# Altium project sokolov_control_board.PrjPcb
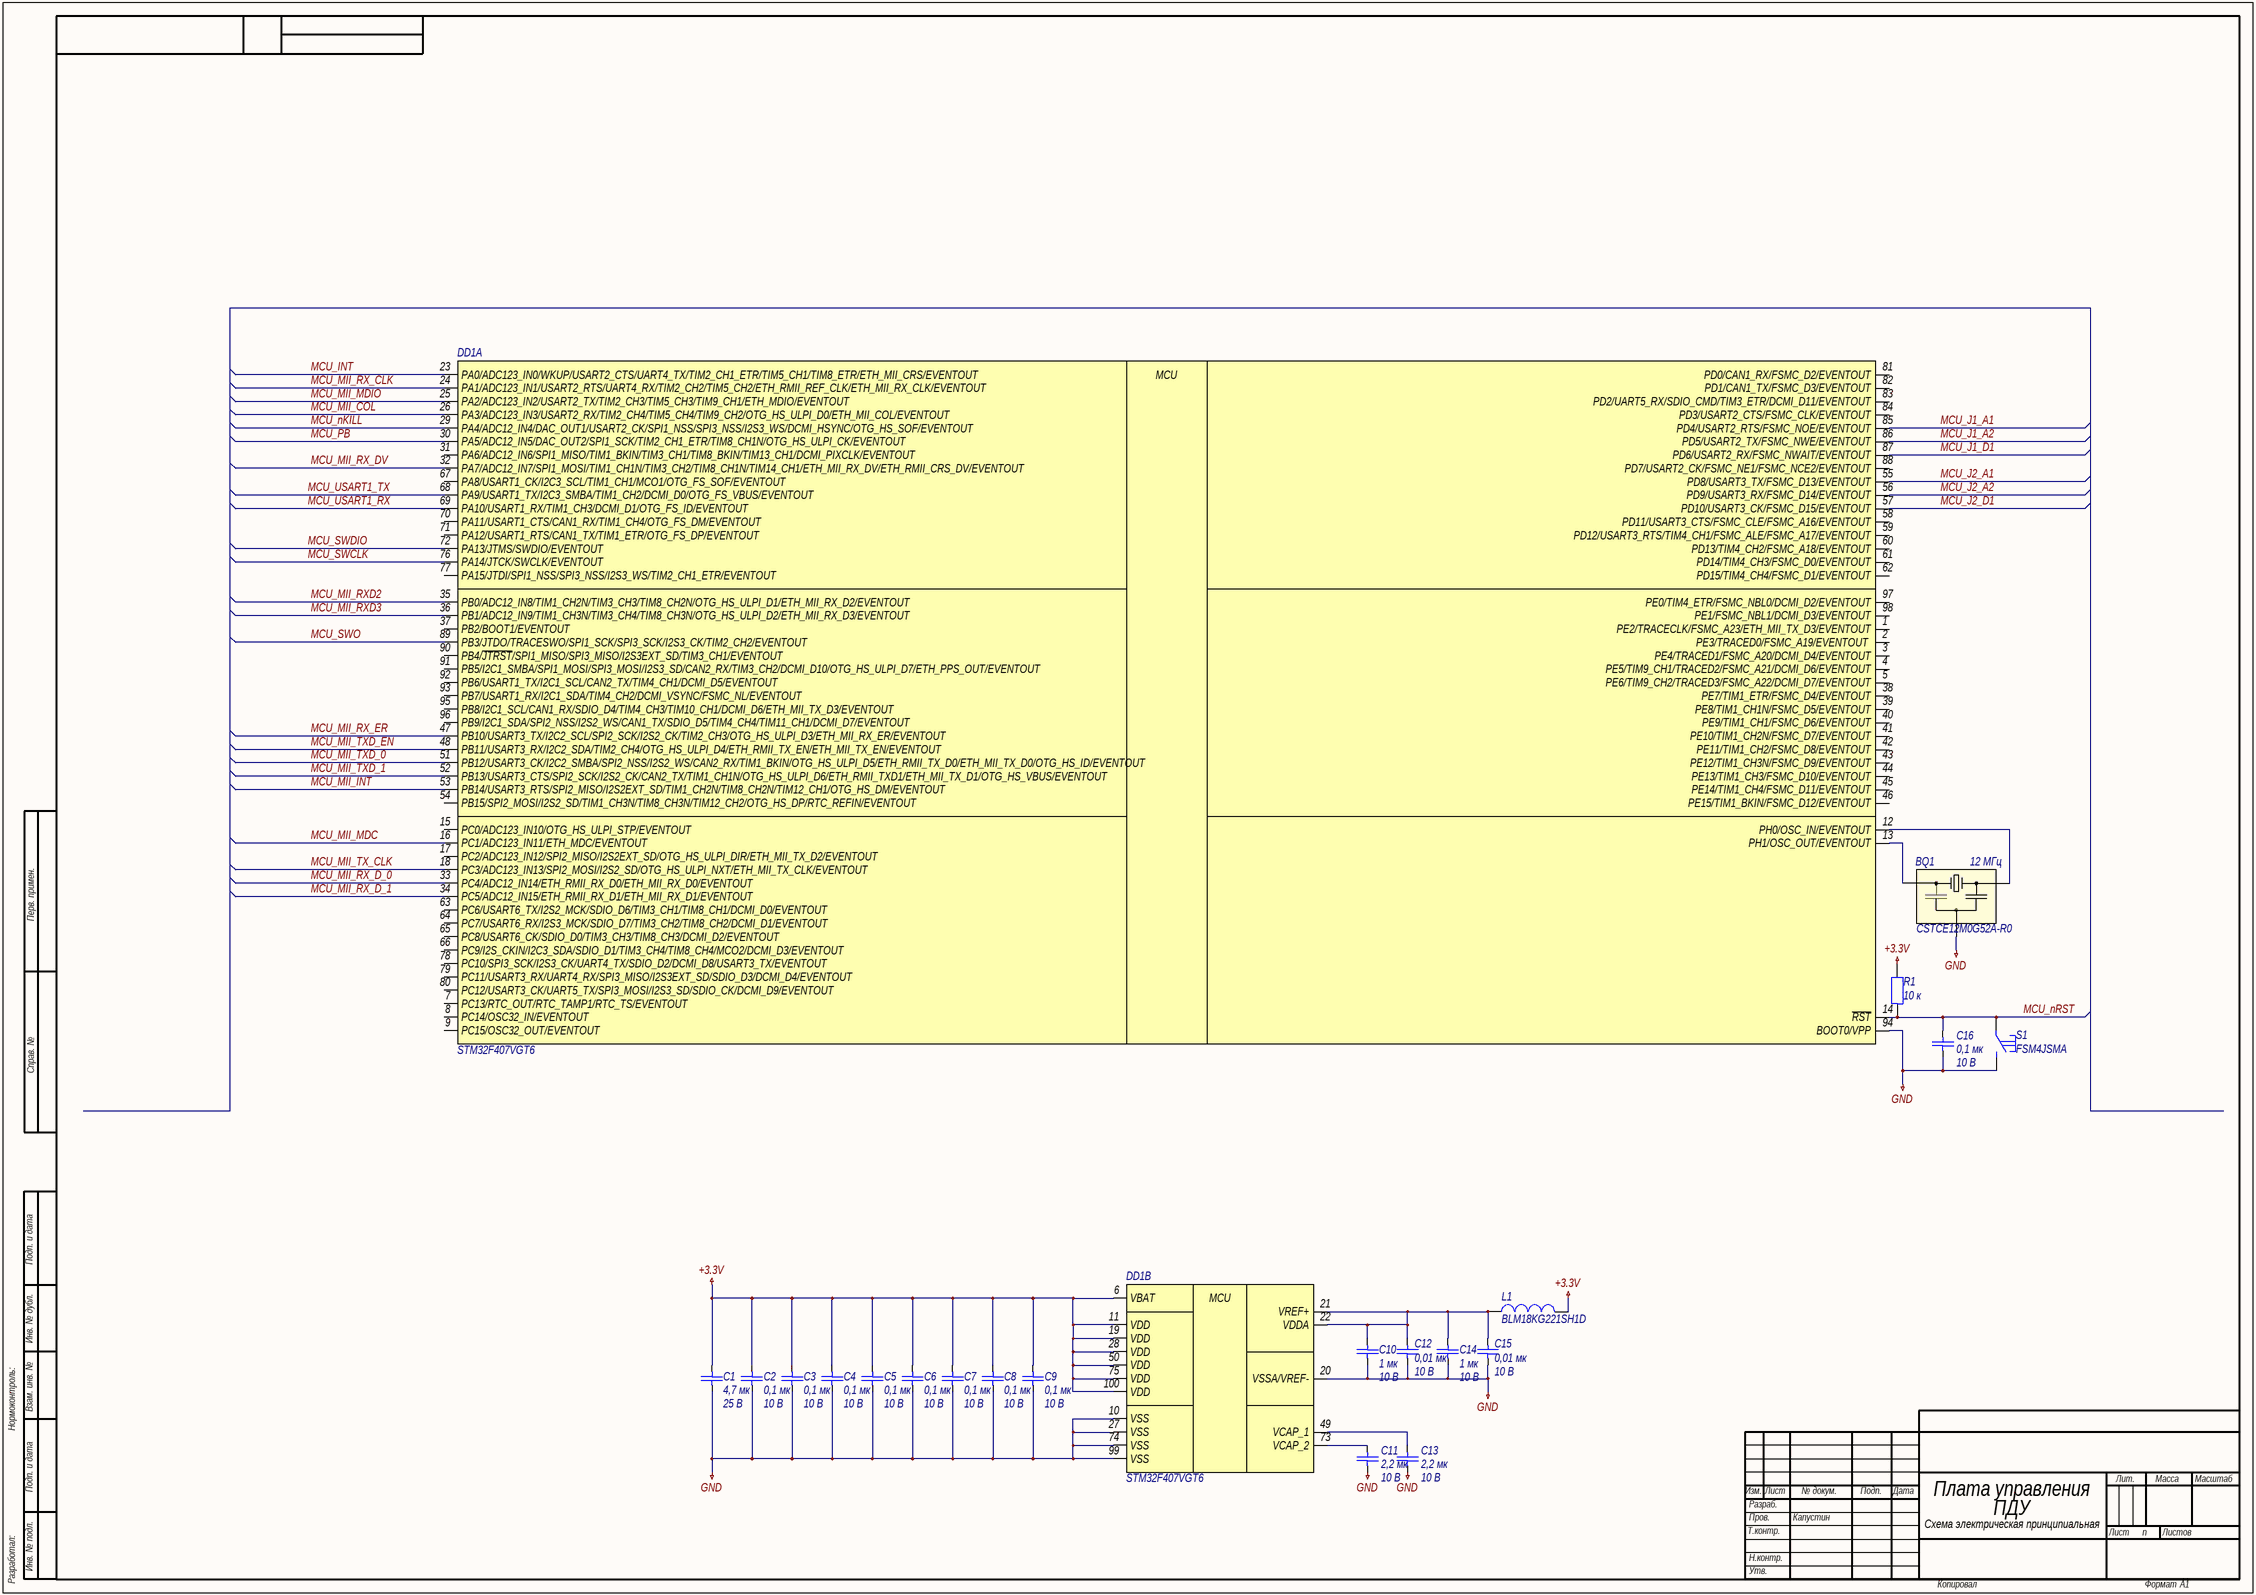
[diagram p0: sokolov_control_board_1.SchDoc]
approver: Капустин; check: Капустин; designation: СПБПУ.3331506.022; developer: Соколов; document_code: Ý3; document_type: Схема электрическая принципиальная; pcb_dec_number: СПБПУ.3331506.022; project: Плата управления ПДУ; sheets_total: 3; title: Плата управления ПДУ; title_line_1: Плата управления; title_line_2: ПДУ
3 sheets, 108 parts. Net scope: global (net labels, ports and power ports of the same name join across sheets).
Board file: 1,5mm_18um_4layers_std.PcbDoc
Sheets:
  sokolov_control_board_1.SchDoc
  sokolov_control_board_2.SchDoc
  sokolov_control_board_3.SchDoc

## Sheet sokolov_control_board_1.SchDoc: Плата управления ПДУ
size 840 x 594 mm; ApprovedBy: Капустин; CheckedBy: Капустин; DrawnBy: Соколов; DocumentNumber: СПБПУ.3331506.022Ý3; SheetNumber: n; SheetTotal: 3; DocumentCode: Ý3; ImagePath: СПБПУ.3331506.022

### Parts
BQ1  CSTCE12M0G52A-R0  Частотa: 12 МГц  [CSTCE-3-P120-320X130X70]
C1  4,7 мк  Напряжение: 25 В  [C0805]
C2  0,1 мк  Напряжение: 10 В  [C0603]
C3  0,1 мк  Напряжение: 10 В  [C0603]
C4  0,1 мк  Напряжение: 10 В  [C0603]
C5  0,1 мк  Напряжение: 10 В  [C0603]
C6  0,1 мк  Напряжение: 10 В  [C0603]
C7  0,1 мк  Напряжение: 10 В  [C0603]
C8  0,1 мк  Напряжение: 10 В  [C0603]
C9  0,1 мк  Напряжение: 10 В  [C0603]
C10  1 мк  Напряжение: 10 В  [C0603]
C11  2,2 мк  Напряжение: 10 В  [C0603]
C12  0,01 мк  Напряжение: 10 В  [C0603]
C13  2,2 мк  Напряжение: 10 В  [C0603]
C14  1 мк  Напряжение: 10 В  [C0603]
C15  0,01 мк  Напряжение: 10 В  [C0603]
C16  0,1 мк  Напряжение: 10 В  [C0603]
DD1  STM32F407VGT6  [LQFP-100-P50-1400X1400X160-L60X22]  (parts A,B of 2)
L1  BLM18KG221SH1D  [BLM-2-0603]
R1  10 к  [R0603]
S1  FSM4JSMA  [FSM4JSMA]

### Nets
+3.3V: C1.2 C2.2 C3.2 C4.2 C5.2 C6.2 C7.2 C8.2 C9.2 DD1.6(VBAT) DD1.11(VDD) DD1.19(VDD) DD1.28(VDD) DD1.50(VDD) DD1.75(VDD) DD1.100(VDD) L1.2 R1.2
GND: BQ1.2 C1.1 C2.1 C3.1 C4.1 C5.1 C6.1 C7.1 C8.1 C9.1 C10.1 C11.2 C12.2 C13.2 C14.1 C15.2 C16.2 DD1.10(VSS) DD1.20(VSSA/VREF-) DD1.27(VSS) DD1.74(VSS) DD1.94(BOOT0/VPP) DD1.99(VSS) S1.2
MCU_INT: DD1.23(PA0/ADC123_IN0/WKUP/USART2_CTS/UART4_TX/TIM2_CH1_ETR/TIM5_CH1/TIM8_ETR/ETH_MII_CRS/EVENTOUT)
MCU_J1_A1: DD1.85(PD4/USART2_RTS/FSMC_NOE/EVENTOUT)
MCU_J1_A2: DD1.86(PD5/USART2_TX/FSMC_NWE/EVENTOUT)
MCU_J1_D1: DD1.87(PD6/USART2_RX/FSMC_NWAIT/EVENTOUT)
MCU_J2_A1: DD1.55(PD8/USART3_TX/FSMC_D13/EVENTOUT)
MCU_J2_A2: DD1.56(PD9/USART3_RX/FSMC_D14/EVENTOUT)
MCU_J2_D1: DD1.57(PD10/USART3_CK/FSMC_D15/EVENTOUT)
MCU_MII_COL: DD1.26(PA3/ADC123_IN3/USART2_RX/TIM2_CH4/TIM5_CH4/TIM9_CH2/OTG_HS_ULPI_D0/ETH_MII_COL/EVENTOUT)
MCU_MII_INT: DD1.53(PB14/USART3_RTS/SPI2_MISO/I2S2EXT_SD/TIM1_CH2N/TIM8_CH2N/TIM12_CH1/OTG_HS_DM/EVENTOUT)
MCU_MII_MDC: DD1.16(PC1/ADC123_IN11/ETH_MDC/EVENTOUT)
MCU_MII_MDIO: DD1.25(PA2/ADC123_IN2/USART2_TX/TIM2_CH3/TIM5_CH3/TIM9_CH1/ETH_MDIO/EVENTOUT)
MCU_MII_RX_CLK: DD1.24(PA1/ADC123_IN1/USART2_RTS/UART4_RX/TIM2_CH2/TIM5_CH2/ETH_RMII_REF_CLK/ETH_MII_RX_CLK/EVENTOUT)
MCU_MII_RX_D_0: DD1.33(PC4/ADC12_IN14/ETH_RMII_RX_D0/ETH_MII_RX_D0/EVENTOUT)
MCU_MII_RX_D_1: DD1.34(PC5/ADC12_IN15/ETH_RMII_RX_D1/ETH_MII_RX_D1/EVENTOUT)
MCU_MII_RX_DV: DD1.32(PA7/ADC12_IN7/SPI1_MOSI/TIM1_CH1N/TIM3_CH2/TIM8_CH1N/TIM14_CH1/ETH_MII_RX_DV/ETH_RMII_CRS_DV/EVENTOUT)
MCU_MII_RX_ER: DD1.47(PB10/USART3_TX/I2C2_SCL/SPI2_SCK/I2S2_CK/TIM2_CH3/OTG_HS_ULPI_D3/ETH_MII_RX_ER/EVENTOUT)
MCU_MII_RXD2: DD1.35(PB0/ADC12_IN8/TIM1_CH2N/TIM3_CH3/TIM8_CH2N/OTG_HS_ULPI_D1/ETH_MII_RX_D2/EVENTOUT)
MCU_MII_RXD3: DD1.36(PB1/ADC12_IN9/TIM1_CH3N/TIM3_CH4/TIM8_CH3N/OTG_HS_ULPI_D2/ETH_MII_RX_D3/EVENTOUT)
MCU_MII_TX_CLK: DD1.18(PC3/ADC123_IN13/SPI2_MOSI/I2S2_SD/OTG_HS_ULPI_NXT/ETH_MII_TX_CLK/EVENTOUT)
MCU_MII_TXD_0: DD1.51(PB12/USART3_CK/I2C2_SMBA/SPI2_NSS/I2S2_WS/CAN2_RX/TIM1_BKIN/OTG_HS_ULPI_D5/ETH_RMII_TX_D0/ETH_MII_TX_D0/OTG_HS_ID/EVENTOUT)
MCU_MII_TXD_1: DD1.52(PB13/USART3_CTS/SPI2_SCK/I2S2_CK/CAN2_TX/TIM1_CH1N/OTG_HS_ULPI_D6/ETH_RMII_TXD1/ETH_MII_TX_D1/OTG_HS_VBUS/EVENTOUT)
MCU_MII_TXD_EN: DD1.48(PB11/USART3_RX/I2C2_SDA/TIM2_CH4/OTG_HS_ULPI_D4/ETH_RMII_TX_EN/ETH_MII_TX_EN/EVENTOUT)
MCU_nKILL: DD1.29(PA4/ADC12_IN4/DAC_OUT1/USART2_CK/SPI1_NSS/SPI3_NSS/I2S3_WS/DCMI_HSYNC/OTG_HS_SOF/EVENTOUT)
MCU_nRST: C16.1 DD1.14(~{RST}) R1.1 S1.1
MCU_PB: DD1.30(PA5/ADC12_IN5/DAC_OUT2/SPI1_SCK/TIM2_CH1_ETR/TIM8_CH1N/OTG_HS_ULPI_CK/EVENTOUT)
MCU_SWCLK: DD1.76(PA14/JTCK/SWCLK/EVENTOUT)
MCU_SWDIO: DD1.72(PA13/JTMS/SWDIO/EVENTOUT)
MCU_SWO: DD1.89(PB3/JTDO/TRACESWO/SPI1_SCK/SPI3_SCK/I2S3_CK/TIM2_CH2/EVENTOUT)
MCU_USART1_RX: DD1.69(PA10/USART1_RX/TIM1_CH3/DCMI_D1/OTG_FS_ID/EVENTOUT)
MCU_USART1_TX: DD1.68(PA9/USART1_TX/I2C3_SMBA/TIM1_CH2/DCMI_D0/OTG_FS_VBUS/EVENTOUT)
NetBQ1_1: BQ1.1 DD1.12(PH0/OSC_IN/EVENTOUT)
NetBQ1_3: BQ1.3 DD1.13(PH1/OSC_OUT/EVENTOUT)
NetC10_2: C10.2 C12.1 C14.2 C15.1 DD1.21(VREF+) DD1.22(VDDA) L1.1
NetC11_1: C11.1 DD1.73(VCAP_2)
NetC13_1: C13.1 DD1.49(VCAP_1)

Not connected (* = marked no-connect by the designer): DD1 1(PE2/TRACECLK/FSMC_A23/ETH_MII_TX_D3/EVENTOUT) 2(PE3/TRACED0/FSMC_A19/EVENTOUT_) 3(PE4/TRACED1/FSMC_A20/DCMI_D4/EVENTOUT) 4(PE5/TIM9_CH1/TRACED2/FSMC_A21/DCMI_D6/EVENTOUT) 5(PE6/TIM9_CH2/TRACED3/FSMC_A22/DCMI_D7/EVENTOUT) 7(PC13/RTC_OUT/RTC_TAMP1/RTC_TS/EVENTOUT) 8(PC14/OSC32_IN/EVENTOUT) 9(PC15/OSC32_OUT/EVENTOUT) 15(PC0/ADC123_IN10/OTG_HS_ULPI_STP/EVENTOUT) 17(PC2/ADC123_IN12/SPI2_MISO/I2S2EXT_SD/OTG_HS_ULPI_DIR/ETH_MII_TX_D2/EVENTOUT) 31(PA6/ADC12_IN6/SPI1_MISO/TIM1_BKIN/TIM3_CH1/TIM8_BKIN/TIM13_CH1/DCMI_PIXCLK/EVENTOUT) 37(PB2/BOOT1/EVENTOUT) 38(PE7/TIM1_ETR/FSMC_D4/EVENTOUT) 39(PE8/TIM1_CH1N/FSMC_D5/EVENTOUT) 40(PE9/TIM1_CH1/FSMC_D6/EVENTOUT) 41(PE10/TIM1_CH2N/FSMC_D7/EVENTOUT) 42(PE11/TIM1_CH2/FSMC_D8/EVENTOUT) 43(PE12/TIM1_CH3N/FSMC_D9/EVENTOUT) 44(PE13/TIM1_CH3/FSMC_D10/EVENTOUT) 45(PE14/TIM1_CH4/FSMC_D11/EVENTOUT) 46(PE15/TIM1_BKIN/FSMC_D12/EVENTOUT) 54(PB15/SPI2_MOSI/I2S2_SD/TIM1_CH3N/TIM8_CH3N/TIM12_CH2/OTG_HS_DP/RTC_REFIN/EVENTOUT) 58(PD11/USART3_CTS/FSMC_CLE/FSMC_A16/EVENTOUT) 59(PD12/USART3_RTS/TIM4_CH1/FSMC_ALE/FSMC_A17/EVENTOUT) 60(PD13/TIM4_CH2/FSMC_A18/EVENTOUT) 61(PD14/TIM4_CH3/FSMC_D0/EVENTOUT) 62(PD15/TIM4_CH4/FSMC_D1/EVENTOUT) 63(PC6/USART6_TX/I2S2_MCK/SDIO_D6/TIM3_CH1/TIM8_CH1/DCMI_D0/EVENTOUT) 64(PC7/USART6_RX/I2S3_MCK/SDIO_D7/TIM3_CH2/TIM8_CH2/DCMI_D1/EVENTOUT) 65(PC8/USART6_CK/SDIO_D0/TIM3_CH3/TIM8_CH3/DCMI_D2/EVENTOUT) 66(PC9/I2S_CKIN/I2C3_SDA/SDIO_D1/TIM3_CH4/TIM8_CH4/MCO2/DCMI_D3/EVENTOUT) 67(PA8/USART1_CK/I2C3_SCL/TIM1_CH1/MCO1/OTG_FS_SOF/EVENTOUT) 70(PA11/USART1_CTS/CAN1_RX/TIM1_CH4/OTG_FS_DM/EVENTOUT) 71(PA12/USART1_RTS/CAN1_TX/TIM1_ETR/OTG_FS_DP/EVENTOUT) 77(PA15/JTDI/SPI1_NSS/SPI3_NSS/I2S3_WS/TIM2_CH1_ETR/EVENTOUT) 78(PC10/SPI3_SCK/I2S3_CK/UART4_TX/SDIO_D2/DCMI_D8/USART3_TX/EVENTOUT_) 79(PC11/USART3_RX/UART4_RX/SPI3_MISO/I2S3EXT_SD/SDIO_D3/DCMI_D4/EVENTOUT) 80(PC12/USART3_CK/UART5_TX/SPI3_MOSI/I2S3_SD/SDIO_CK/DCMI_D9/EVENTOUT) 81(PD0/CAN1_RX/FSMC_D2/EVENTOUT) 82(PD1/CAN1_TX/FSMC_D3/EVENTOUT) 83(PD2/UART5_RX/SDIO_CMD/TIM3_ETR/DCMI_D11/EVENTOUT) 84(PD3/USART2_CTS/FSMC_CLK/EVENTOUT) 88(PD7/USART2_CK/FSMC_NE1/FSMC_NCE2/EVENTOUT) 90(PB4/~{JTRST}/SPI1_MISO/SPI3_MISO/I2S3EXT_SD/TIM3_CH1/EVENTOUT) 91(PB5/I2C1_SMBA/SPI1_MOSI/SPI3_MOSI/I2S3_SD/CAN2_RX/TIM3_CH2/DCMI_D10/OTG_HS_ULPI_D7/ETH_PPS_OUT/EVENTOUT) 92(PB6/USART1_TX/I2C1_SCL/CAN2_TX/TIM4_CH1/DCMI_D5/EVENTOUT) 93(PB7/USART1_RX/I2C1_SDA/TIM4_CH2/DCMI_VSYNC/FSMC_NL/EVENTOUT) 95(PB8/I2C1_SCL/CAN1_RX/SDIO_D4/TIM4_CH3/TIM10_CH1/DCMI_D6/ETH_MII_TX_D3/EVENTOUT) 96(PB9/I2C1_SDA/SPI2_NSS/I2S2_WS/CAN1_TX/SDIO_D5/TIM4_CH4/TIM11_CH1/DCMI_D7/EVENTOUT) 97(PE0/TIM4_ETR/FSMC_NBL0/DCMI_D2/EVENTOUT) 98(PE1/FSMC_NBL1/DCMI_D3/EVENTOUT)

### Notes on the sheet
- Перв. примен.
- Справ. №
- Подп. и дата
- Инв. № дубл.
- Нормоконтроль:
- Взам. инв. №
- Изм.
- Лист
- № докум.
- Подп.
- Дата
- Лит.
- Масса
- Масштаб
- Т.контр.
- Пров.
- Разраб.
- Листов
- Разработал:
- Инв. № подл.
- Н.контр.
- Утв.
- Копировал
- Формат
- А1
- (in symbol dd0002, part A) MCU
- (in symbol dd0002, part B) MCU

### Library data of the parts
BQ1 = bq0002: =Описание; ID: bq0002; Фамилия: Самарин; Описание: Керамический резонатор 12 МГц со встроенными конденсаторами; Производитель: Murata Manufacturing Co., Ltd.; Корпус: 3,20 x 1,30 x 0,70; Наименование: CSTCE12M0G52A-R0; Частота: 12 МГц; HelpURL: https://www.murata.com/products/productdetail?partno=CSTCE12M0G52A-R0
C1 = c0139: =Описание; ID: c0139; Фамилия: Паньков; Описание: Конденсатор керамический чип 0805 4,7 мкФ 25 В ±10 %; Наименование: CC0805KKX7R8BB475; Производитель: YAGEO Corp.; Отклонение: ±10 %; Рабочие температуры: от –55 °С до +125 °С; Температурный коэффициент емкости: X7R; Корпус: 0805; Номинал: 4,7 мк; Номинальное напряжение: 25 В; HelpURL: https://www.yageo.com/upload/media/product/productsearch/datasheet/mlcc/UPY-GPHC_X7R_6.3V-to-50V_20.pdf
C2-C9 = c0081: =Описание; ID: c0081; Фамилия: Паньков; Описание: Конденсатор керамический чип 0603 100 нФ 10 В ±10 %; Наименование: CC0603KRX7R6BB104; Производитель: YAGEO Corp.; Отклонение: ±10 %; Рабочие температуры: от –55 °С до +125 °С; Температурный коэффициент емкости: X7R; Корпус: 0603; Номинал: 0,1 мк; Номинальное напряжение: 10 В; HelpURL: https://www.yageo.com/upload/media/product/productsearch/datasheet/mlcc/UPY-GPHC_X7R_6.3V-to-50V_20.pdf
C10 C14 = c0113: =Описание; ID: c0113; Фамилия: Паньков; Описание: Конденсатор керамический чип 0603 1 мкФ 10 В ±10 %; Наименование: CC0603KRX7R6BB105; Производитель: YAGEO Corp.; Отклонение: ±10 %; Рабочие температуры: от –55 °С до +125 °С; Температурный коэффициент емкости: X7R; Корпус: 0603; Номинал: 1 мк; Номинальное напряжение: 10 В; HelpURL: https://www.yageo.com/upload/media/product/productsearch/datasheet/mlcc/UPY-GPHC_X7R_6.3V-to-50V_20.pdf
C11 C13 = c0097: =Описание; ID: c0097; Фамилия: Чернов; Описание: Конденсатор керамический чип 0603 2,2 мкФ 10 В ±10 %; Наименование: CC0603KRX7R6BB225; Производитель: YAGEO Corp.; Отклонение: ±10 %; Рабочие температуры: от –55 °С до +125 °С; Температурный коэффициент емкости: X7R; Корпус: 0603; Номинал: 2,2 мк; Номинальное напряжение: 10 В; HelpURL: https://www.yageo.com/upload/media/product/productsearch/datasheet/mlcc/UPY-GPHC_X7R_6.3V-to-50V_20.pdf
C12 C15 = c0033: =Описание; ID: c0033; Фамилия: Паньков; Описание: Конденсатор керамический чип 0603 10 нФ 10 В ±10 %; Наименование: CC0603KRX7R6BB103; Производитель: YAGEO Corp.; Отклонение: ±10 %; Рабочие температуры: от –55 °С до +125 °С; Температурный коэффициент емкости: X7R; Корпус: 0603; Номинал: 0,01 мк; Номинальное напряжение: 10 В; HelpURL: https://www.yageo.com/upload/media/product/productsearch/datasheet/mlcc/UPY-GPHC_X7R_6.3V-to-50V_20.pdf
C16 = c0057: =Описание; ID: c0057; Фамилия: Паньков; Описание: Конденсатор керамический чип 0603 100 нФ 10 В ±10 %; Наименование: CC0603KRX7R6BB104; Производитель: YAGEO Corp.; Отклонение: ±10 %; Рабочие температуры: от –55 °С до +125 °С; Температурный коэффициент емкости: X7R; Корпус: 0603; Номинал: 0,1 мк; Номинальное напряжение: 10 В; HelpURL: https://www.yageo.com/upload/media/product/productsearch/datasheet/mlcc/UPY-GPHC_X7R_6.3V-to-50V_20.pdf
DD1 = dd0002: =Описание; ID: dd0002; Фамилия: Паньков; Описание: ARM Cortex-M4 32-разрядный микроконтроллер 168 МГц 1 Мбайт FLASH-памяти; Производитель: STMicroelectronics; Рабочее напряжение: от 1,8 В до 3,6 В; Максимальная тактовая частота: 168 МГц; Поддерживаемые интерфейсы: CAN, I2C, SDIO, I2S/SPI, UART/USART, USB; Рабочие температуры: от –40 °С до +85 °С; Корпус: LQFP-100; Наименование: STM32F407VGT6; HelpURL: https://www.st.com/en/microcontrollers-microprocessors/stm32f407vg.html
L1 = l0001: =Описание; ID: l0001; Фамилия: Ларионов; Описание: Ферритовая бусина 220 Ом ±25 %; Производитель: Murata Manufacturing Co., Ltd.; Сопротивление, 100 МГц: 220 Ом; Отклонение, 100 МГц: ±25 %; Сопротивление при постоянном токе: 0,05 Ом; Рабочие температуры: от –55 °С до +125 °С; Корпус: 0603; Наименование: BLM18KG221SH1D; HelpURL: https://www.murata.com/en-global/products/productdetail?partno=BLM18KG221SH1%23
R1 = r0105: =Описание; ID: r0105; Фамилия: Самарин; Описание: Резистор чип 0603 10 кОм ±1 % 0,1 Вт; Наименование: RC0603FR-0710KL; Производитель: YAGEO Corp.; Отклонение: ±1 %; Номинальное напряжение: 75 В; Номинальный ток: 1 А; Рабочие температуры: от –55 °С до +155 °С; Корпус: 0603; Примечание: Ряд E24; Номинал: 10 к; HelpURL: https://www.yageo.com/upload/media/product/productsearch/datasheet/rchip/PYu-RC_Group_51_RoHS_L_11.pdf
S1 = s0001: =Описание; ID: s0001; Фамилия: Паньков; Описание: Тактовая кнопка поверхностного монтажа; Производитель: TE Connectivity; Ток нагрузки: 50 мА @ 24 В; Сопротивление контакта: 100 мОм; Количество контактов: 4; Рабочие температуры: от –35 °С до +85 °С; Промывка: Запрещена; Корпус: 6,00 x 6,00 x 4,98; Наименование: FSM4JSMA; HelpURL: https://www.te.com/usa-en/product-4-1437565-1.html

## Sheet sokolov_control_board_2.SchDoc: Плата управления ПДУ
size 840 x 594 mm; ApprovedBy: Капустин; CheckedBy: Капустин; DrawnBy: Соколов; DocumentNumber: СПБПУ.3331506.022Ý3; SheetNumber: 2; SheetTotal: 3; DocumentCode: Ý3; ImagePath: СПБПУ.3331506.022
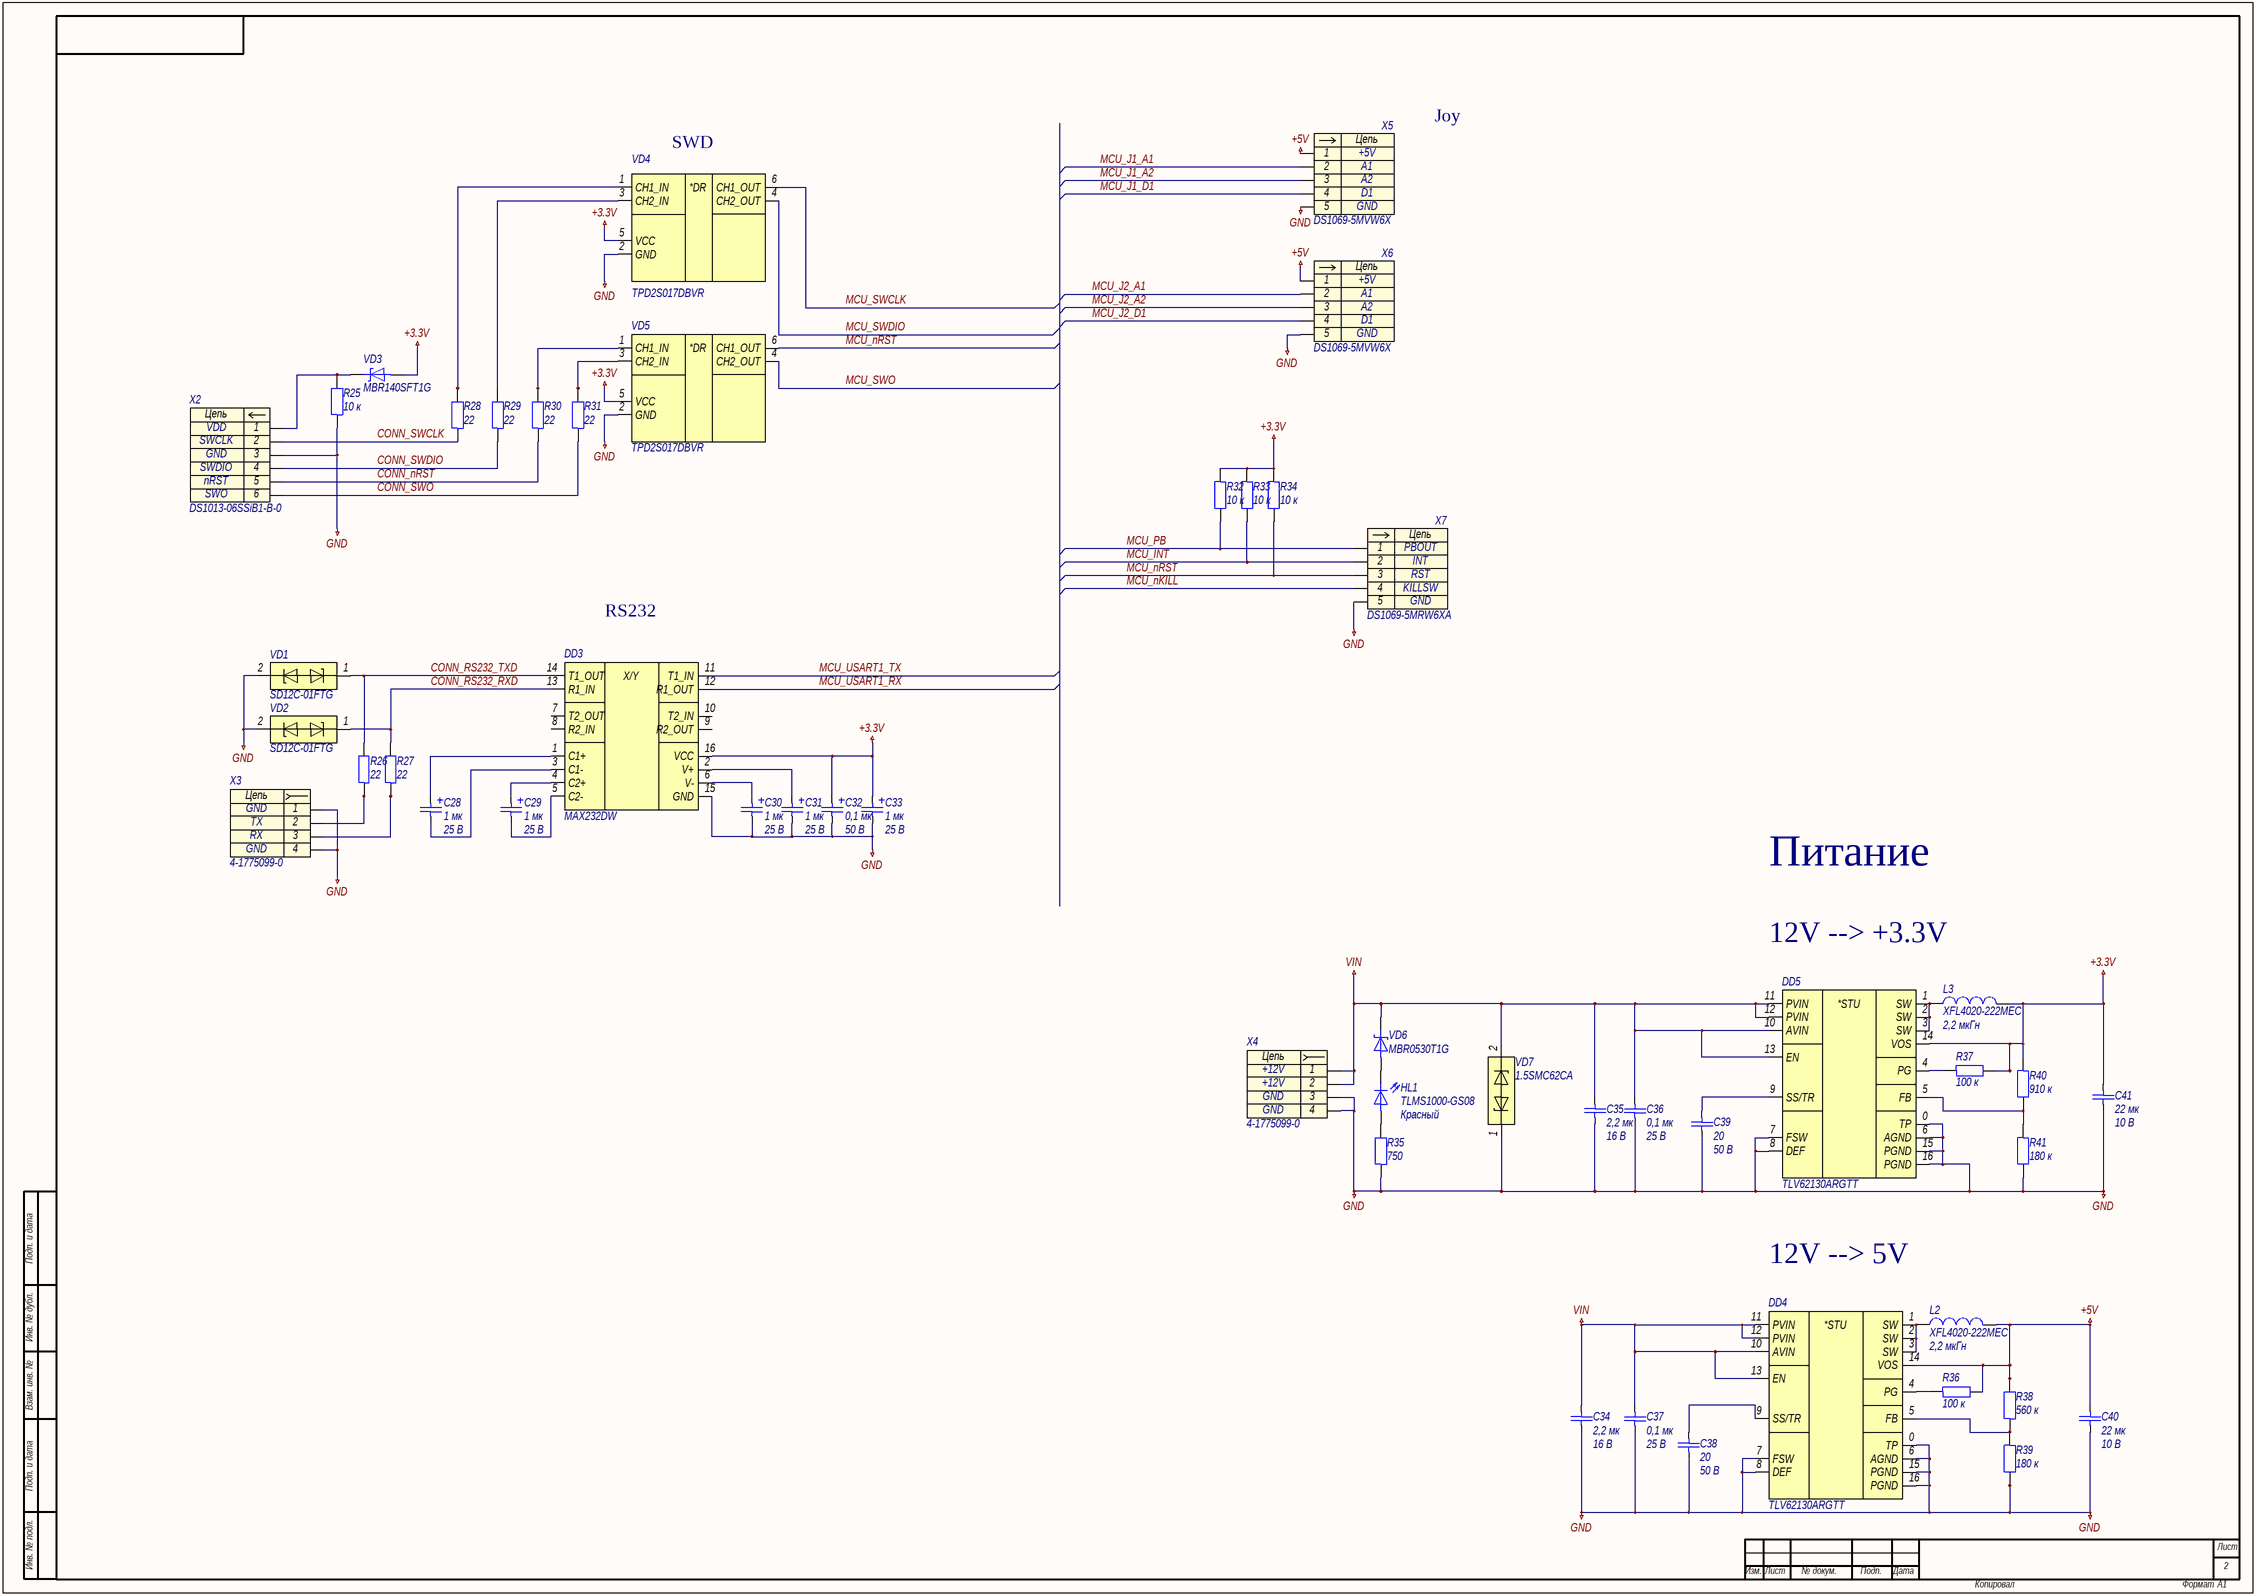
[diagram p1: sokolov_control_board_2.SchDoc]

### Parts
C28  1 мк  Напряжение: 25 В  [C3216-18]
C29  1 мк  Напряжение: 25 В  [C3216-18]
C30  1 мк  Напряжение: 25 В  [C3216-18]
C31  1 мк  Напряжение: 25 В  [C3216-18]
C32  0,1 мк  Напряжение: 50 В  [C3216-18]
C33  1 мк  Напряжение: 25 В  [C3216-18]
C34  2,2 мк  Напряжение: 16 В  [C0603]
C35  2,2 мк  Напряжение: 16 В  [C0603]
C36  0,1 мк  Напряжение: 25 В  [C0603]
C37  0,1 мк  Напряжение: 25 В  [C0603]
C38  20  Напряжение: 50 В  [C0603]
C39  20  Напряжение: 50 В  [C0603]
C40  22 мк  Напряжение: 10 В  [C1206]
C41  22 мк  Напряжение: 10 В  [C1206]
DD3  MAX232DW  [SOIC-16-P127-1030X750X265-L84X41]
DD4  TLV62130ARGTT  [WQFN-16-P50-300X300X100-L40X24-T168X168]
DD5  TLV62130ARGTT  [WQFN-16-P50-300X300X100-L40X24-T168X168]
HL1  TLMS1000-GS08  Цвет: Красный  [HL0603]
L2  XFL4020-222MEC  Индуктивность: 2,2 мкГн  [XFL-2-400X400X210]
L3  XFL4020-222MEC  Индуктивность: 2,2 мкГн  [XFL-2-400X400X210]
R25  10 к  [R0603]
R26  22  [R0603]
R27  22  [R0603]
R28  22  [R0603]
R29  22  [R0603]
R30  22  [R0603]
R31  22  [R0603]
R32  10 к  [R0603]
R33  10 к  [R0603]
R34  10 к  [R0603]
R35  750  [R0603]
R36  100 к  [R0603]
R37  100 к  [R0603]
R38  560 к  [R0603]
R39  180 к  [R0603]
R40  910 к  [R0603]
R41  180 к  [R0603]
VD1  SD12C-01FTG  [SOD-323-257X130X114]
VD2  SD12C-01FTG  [SOD-323-257X130X114]
VD3  MBR140SFT1G  [SOD-123FL-370X165X98]
VD4  TPD2S017DBVR  [SOT-23-6-P95-290X280X145]
VD5  TPD2S017DBVR  [SOT-23-6-P95-290X280X145]
VD6  MBR0530T1G  [SOD-123-368X160X135]
VD7  1.5SMC62CA  [DO-214AB-790X590X262]
X2  DS1013-06SSiB1-B-0  [DS1013-06SSiB1-B-0]
X3  4-1775099-0  [4-1775099-0]
X4  4-1775099-0  [4-1775099-0]
X5  DS1069-5MVW6X  [DS1069-5MVW6X]
X6  DS1069-5MVW6X  [DS1069-5MVW6X]
X7  DS1069-5MRW6XA  [DS1069-5MRW6XA]

### Nets
+3.3V: C32.1 C33.1 C41.2 DD3.16(VCC) DD5.14(VOS) L3.2 R32.1 R33.1 R34.1 R37.2 R40.1 VD3.2 VD4.5(VCC) VD5.5(VCC)
+5V: C40.2 DD4.14(VOS) L2.2 R36.2 R38.2 X5.1 X6.1
GND: C30.2 C31.2 C32.2 C33.2 C34.1 C35.1 C36.2 C37.2 C38.1 C39.1 C40.1 C41.1 DD3.15(GND) DD4.0(TP) DD4.6(AGND) DD4.7(FSW) DD4.8(DEF) DD4.15(PGND) DD4.16(PGND) DD5.0(TP) DD5.6(AGND) DD5.7(FSW) DD5.8(DEF) DD5.15(PGND) DD5.16(PGND) R25.1 R35.1 R39.2 R41.2 VD1.2 VD2.2 VD4.2(GND) VD5.2(GND) VD7.1 X2.3 X3.1 X3.4 X4.3 X4.4 X5.5 X6.5 X7.5
VIN: C34.2 C35.2 C36.1 C37.1 DD4.10(AVIN) DD4.11(PVIN) DD4.12(PVIN) DD4.13(EN) DD5.10(AVIN) DD5.11(PVIN) DD5.12(PVIN) DD5.13(EN) VD6.1 VD7.2 X4.1 X4.2
CONN_nRST: R30.1 X2.5
CONN_RS232_RXD: DD3.13(R1_IN) R27.2 VD2.1
CONN_RS232_TXD: DD3.14(T1_OUT) R26.2 VD1.1
CONN_SWCLK: R28.1 X2.2
CONN_SWDIO: R29.1 X2.4
CONN_SWO: R31.1 X2.6
MCU_INT: R33.2 X7.2
MCU_J1_A1: X5.2
MCU_J1_A2: X5.3
MCU_J1_D1: X5.4
MCU_J2_A1: X6.2
MCU_J2_A2: X6.3
MCU_J2_D1: X6.4
MCU_nKILL: X7.4
MCU_nRST: R34.2 VD5.6(CH1_OUT) X7.3
MCU_PB: R32.2 X7.1
MCU_SWCLK: VD4.6(CH1_OUT)
MCU_SWDIO: VD4.4(CH2_OUT)
MCU_SWO: VD5.4(CH2_OUT)
MCU_USART1_RX: DD3.12(R1_OUT)
MCU_USART1_TX: DD3.11(T1_IN)
NetC28_1: C28.1 DD3.1(C1+)
NetC28_2: C28.2 DD3.3(C1-)
NetC29_1: C29.1 DD3.4(C2+)
NetC29_2: C29.2 DD3.5(C2-)
NetC30_1: C30.1 DD3.6(V-)
NetC31_1: C31.1 DD3.2(V+)
NetC38_2: C38.2 DD4.9(SS/TR)
NetC39_2: C39.2 DD5.9(SS/TR)
NetDD4_1: DD4.1(SW) DD4.2(SW) DD4.3(SW) L2.1
NetDD4_4: DD4.4(PG) R36.1
NetDD4_5: DD4.5(FB) R38.1 R39.1
NetDD5_1: DD5.1(SW) DD5.2(SW) DD5.3(SW) L3.1
NetDD5_4: DD5.4(PG) R37.1
NetDD5_5: DD5.5(FB) R40.2 R41.1
NetHL1_1: HL1.1 VD6.2
NetHL1_2: HL1.2 R35.2
NetR25_2: R25.2 VD3.1 X2.1
NetR26_1: R26.1 X3.2
NetR27_1: R27.1 X3.3
NetR28_2: R28.2 VD4.1(CH1_IN)
NetR29_2: R29.2 VD4.3(CH2_IN)
NetR30_2: R30.2 VD5.1(CH1_IN)
NetR31_2: R31.2 VD5.3(CH2_IN)

Not connected (* = marked no-connect by the designer): DD3 7(T2_OUT) 8(R2_IN) 9(R2_OUT) 10(T2_IN)

### Notes on the sheet
- Joy
- SWD
- RS232
- Питание
- 12V --> +3.3V
- 12V --> 5V
- Подп. и дата
- Инв. № дубл.
- Взам. инв. №
- Инв. № подл.
- Лист
- Изм.
- № докум.
- Подп.
- Дата
- Копировал
- Формат
- А1
- (in symbol dd0014) X/Y
- (in symbol dd0017) *STU
- (in symbol vd0016) *DR
- (in symbol x0006) Цепь
- (in symbol x0022) Цепь
- (in symbol x0046) Цепь
- (in symbol x0047) Цепь

### Library data of the parts
C28-C31 C33 = c0014: =Описание; ID: c0014; Фамилия: Ларионов; Описание: Конденсатор танталовый чип 3216-18 1 мкФ 25 В ±10 %; Наименование: 293D105X9025A2TE3; Производитель: Vishay Intertechnology, Inc.; Отклонение: ±10 %; Эквивалентное последовательное сопротивление: 7,6 Ом; Среднеквадратичный размах пульсации тока: 0,10 А; Рабочие температуры: от –55 °С до +125 °С; Корпус: 3216-18; Номинал: 1 мк; Номинальное напряжение: 25 В; HelpURL: https://www.vishay.com/capacitors/list/product-40002/
C32 = c0001: =Описание; ID: c0001; Фамилия: Ларионов; Описание: Конденсатор танталовый чип 3216-18 100 нФ 50 В ±10 %; Наименование: 293D104X9050A2TE3; Производитель: Vishay Intertechnology, Inc.; Отклонение: ±10 %; Эквивалентное последовательное сопротивление: 19,0 Ом; Среднеквадратичный размах пульсации тока: 0,06 А; Рабочие температуры: от –55 °С до +125 °С; Корпус: 3216-18; Номинал: 0,1 мк; Номинальное напряжение: 50 В; HelpURL: https://www.vishay.com/capacitors/list/product-40002/
C34 C35 = c0126: =Описание; ID: c0126; Фамилия: Паньков; Описание: Конденсатор керамический чип 0603 2,2 мкФ 16 В ±10 %; Наименование: CC0603KRX7R7BB225; Производитель: YAGEO Corp.; Отклонение: ±10 %; Рабочие температуры: от –55 °С до +125 °С; Температурный коэффициент емкости: X7R; Корпус: 0603; Номинал: 2,2 мк; Номинальное напряжение: 16 В; HelpURL: https://www.yageo.com/upload/media/product/productsearch/datasheet/mlcc/UPY-GPHC_X7R_6.3V-to-50V_20.pdf
C36 C37 = c0063: =Описание; ID: c0063; Фамилия: Паньков; Описание: Конденсатор керамический чип 0603 100 нФ 25 В ±10 %; Наименование: CC0603KRX7R8BB104; Производитель: YAGEO Corp.; Отклонение: ±10 %; Рабочие температуры: от –55 °С до +125 °С; Температурный коэффициент емкости: X7R; Корпус: 0603; Номинал: 0,1 мк; Номинальное напряжение: 25 В; HelpURL: https://www.yageo.com/upload/media/product/productsearch/datasheet/mlcc/UPY-GPHC_X7R_6.3V-to-50V_20.pdf
C38 C39 = c0021: =Описание; ID: c0021; Фамилия: Паньков; Описание: Конденсатор керамический чип 0603 20 пФ 50 В ±1 %; Наименование: CC0603FRNPO9BN200; Производитель: YAGEO Corp.; Отклонение: ±1 %; Рабочие температуры: от –55 °С до +125 °С; Температурный коэффициент емкости: C0G; Корпус: 0603; Номинал: 20; Номинальное напряжение: 50 В; HelpURL: https://www.yageo.com/upload/media/product/productsearch/datasheet/mlcc/UPY-GP_NP0_16V-to-50V_18.pdf
C40 C41 = c0159: =Описание; ID: c0159; Фамилия: Паньков; Описание: Конденсатор керамический чип 1206 22 мкФ 10 В ±10 %; Наименование: CC1206KKX5R6BB226; Производитель: YAGEO Corp.; Отклонение: ±10 %; Рабочие температуры: от –55 °С до +85 °С; Температурный коэффициент емкости: X5R; Корпус: 1206; Номинал: 22 мк; Номинальное напряжение: 10 В; HelpURL: https://www.yageo.com/upload/media/product/productsearch/datasheet/mlcc/UPY-GPHC_X5R_4V-to-50V_26.pdf
DD3 = dd0014: =Описание; ID: dd0014; Фамилия: Паньков; Описание: Приемопередатчик RS-232; Производитель: Texas Instruments Inc.; Рабочие температуры: от 0 до +70 °C; Корпус: SOIC-16; Наименование: MAX232DW; HelpURL: https://www.ti.com/product/MAX232
DD4 DD5 = dd0017: =Описание; ID: dd0017; Фамилия: Самарин; Описание: Понижающий преобразователь напряжения 3,0…17 В / 0,9…5,25 В и 3,0 А; Производитель: Texas Instruments Inc.; Входное напряжение: от 3,0 В до 17 В; Выходное напряжение: от 0,9 до 5,25 В; Коммутируемый ток: до 3,0 А; Частота переключения: от 1,25 МГц до 2,5 МГц; Рабочие температуры: от –40 °С до +85 °С; Корпус: WQFN-16; Наименование: TLV62130ARGTT; HelpURL: https://www.ti.com/product/TLV62130
HL1 = hl0001: =Описание; ID: hl0001; Фамилия: Ларионов; Описание: Светодиод чип 0603 красный; Производитель: Vishay Intertechnology, Inc.; Номинальная сила света: 4 мкд; Номинальная длина волны: 628 нм; Номинальный прямой ток: 15 мА; Номинальное падение напряжения: 1,8 В; Рассеиваемая мощность: 40 мВт; Рабочие температуры: от –40 °С до +100 °С; Корпус: 0603; Наименование: TLMS1000-GS08; HelpURL: https://www.vishay.com/leds/list/product-83172/
L2 L3 = l0002: =Описание; ID: l0002; Фамилия: Ларионов; Описание: Катушка индуктивности 2,2 мкГн ±20 %; Производитель: Coilcraft, Inc.; Отклонение: ±20 %; Номинальное активное сопротивление: 21,35 мОм; Максимальное активное сопротивление: 23,5 мОм; Резонансная частота: 38 МГц; Номинальный ток (при нагреве на 20 °С/40 °С): 6 А; Ток насыщения: 3,5 А; Рабочее напряжение: от 0 В до 20 В; Рабочие температуры: от –40 °С до +125 °С; Корпус: 4,0 x 4,0 x 2,1; Наименование: XFL4020-222MEC; Номинал: 2,2 мкГн; HelpURL: https://www.coilcraft.com/en-us/products/power/shielded-inductors/molded-inductor/xfl/xfl4020/
R25 R32-R34 = r0105: as R1 on sheet sokolov_control_board_1; Номинал: 10 к; HelpURL: https://www.yageo.com/upload/media/product/productsearch/datasheet/rchip/PYu-RC_Group_51_RoHS_L_11.pdf
R26 R27 = r0004: =Описание; ID: r0004; Фамилия: Ларионов; Описание: Резистор чип 0603 22 Ом ±1 % 0,1 Вт; Наименование: RC0603FR-0722RL; Производитель: YAGEO Corp.; Отклонение: ±1 %; Номинальное напряжение: 75 В; Номинальный ток: 1 А; Рабочие температуры: от –55 °С до +155 °С; Корпус: 0603; Примечание: Ряд E24; Номинал: 22; HelpURL: https://www.yageo.com/upload/media/product/productsearch/datasheet/rchip/PYu-RC_Group_51_RoHS_L_11.pdf
R28-R31 = r0034: =Описание; ID: r0034; Фамилия: Ларионов; Описание: Резистор чип 0603 22 Ом ±1 % 0,1 Вт; Наименование: RC0603FR-0722RL; Производитель: YAGEO Corp.; Отклонение: ±1 %; Номинальное напряжение: 75 В; Номинальный ток: 1 А; Рабочие температуры: от –55 °С до +155 °С; Корпус: 0603; Примечание: Ряд E24; Номинал: 22; HelpURL: https://www.yageo.com/upload/media/product/productsearch/datasheet/rchip/PYu-RC_Group_51_RoHS_L_11.pdf
R35 = r0028: =Описание; ID: r0028; Фамилия: Паньков; Описание: Резистор чип 0603 750 Ом ±1 % 0,1 Вт; Наименование: RC0603FR-07750RL; Производитель: YAGEO Corp.; Отклонение: ±1 %; Номинальное напряжение: 75 В; Номинальный ток: 1 А; Рабочие температуры: от –55 °С до +155 °С; Корпус: 0603; Примечание: Ряд E24; Номинал: 750; HelpURL: https://www.yageo.com/upload/media/product/productsearch/datasheet/rchip/PYu-RC_Group_51_RoHS_L_11.pdf
R36 R37 = r0141: =Описание; ID: r0141; Фамилия: Водорезов; Описание: Резистор чип 0603 100 кОм ±1 % 0,1 Вт; Наименование: RC0603FR-07100KL; Производитель: YAGEO Corp.; Отклонение: ±1 %; Номинальное напряжение: 75 В; Номинальный ток: 1 А; Рабочие температуры: от –55 °С до +155 °С; Корпус: 0603; Примечание: Ряд E24; Номинал: 100 к; HelpURL: https://www.yageo.com/upload/media/product/productsearch/datasheet/rchip/PYu-RC_Group_51_RoHS_L_11.pdf
R38 = r0167: =Описание; ID: r0167; Фамилия: Паньков; Описание: Резистор чип 0603 560 кОм ±1 % 0,1 Вт; Наименование: RC0603FR-07560KL; Производитель: YAGEO Corp.; Отклонение: ±1 %; Номинальное напряжение: 75 В; Номинальный ток: 1 А; Рабочие температуры: от –55 °С до +155 °С; Корпус: 0603; Примечание: Ряд E24; Номинал: 560 к; HelpURL: https://www.yageo.com/upload/media/product/productsearch/datasheet/rchip/PYu-RC_Group_51_RoHS_L_11.pdf
R39 R41 = r0152: =Описание; ID: r0152; Фамилия: Паньков; Описание: Резистор чип 0603 180 кОм ±1 % 0,1 Вт; Наименование: RC0603FR-07180KL; Производитель: YAGEO Corp.; Отклонение: ±1 %; Номинальное напряжение: 75 В; Номинальный ток: 1 А; Рабочие температуры: от –55 °С до +155 °С; Корпус: 0603; Примечание: Ряд E24; Номинал: 180 к; HelpURL: https://www.yageo.com/upload/media/product/productsearch/datasheet/rchip/PYu-RC_Group_51_RoHS_L_11.pdf
R40 = r0172: =Описание; ID: r0172; Фамилия: Паньков; Описание: Резистор чип 0603 910 кОм ±1 % 0,1 Вт; Наименование: RC0603FR-07910KL; Производитель: YAGEO Corp.; Отклонение: ±1 %; Номинальное напряжение: 75 В; Номинальный ток: 1 А; Рабочие температуры: от –55 °С до +155 °С; Корпус: 0603; Примечание: Ряд E24; Номинал: 910 к; HelpURL: https://www.yageo.com/upload/media/product/productsearch/datasheet/rchip/PYu-RC_Group_51_RoHS_L_11.pdf
VD1 VD2 = vd0004: =Описание; ID: vd0004; Фамилия: Ларионов; Описание: Двунаправленная диодная сборка для подавления помех 12 В; Производитель: Littelfuse, Inc.; Корпус: SOD-323; Наименование: SD12C-01FTG; HelpURL: https://www.littelfuse.com/products/tvs-diode-arrays/general-purpose-esd-protection/sdc/sd12c_01ftg.aspx
VD3 = vd0002: =Описание; ID: vd0002; Фамилия: Паньков; Описание: Диод Шоттки 40 В 1 А; Производитель: ON Semiconductor; Максимальное прямое напряжение: 0,88 В; Максимальное обратное напряжение: 40 В; Максимальный прямой ток: 1 А; Рабочие температуры: от –55 °С до +125 °С; Корпус: SOD-123FL; Наименование: MBR140SFT1G; HelpURL: https://www.onsemi.com/products/discretes-drivers/diodes-rectifiers/schottky-diodes-schottky-rectifiers/mbr140sf
VD4 VD5 = vd0016: =Описание; ID: vd0016; Фамилия: Паньков; Описание: Диодная сборка для подавления помех 5 В; Производитель: Texas Instruments Inc.; Корпус: SOT-23-6; Наименование: TPD2S017DBVR; HelpURL: https://www.ti.com/product/TPD2S017
VD6 = vd0001: =Описание; ID: vd0001; Фамилия: Шкабара; Описание: Диод Шоттки 30 В 0,5 А; Производитель: ON Semiconductor; Максимальное прямое напряжение: 0,43 В; Максимальное обратное напряжение: 30 В; Максимальный прямой ток: 0,5 А; Рабочие температуры: от –65 °С до +125 °С; Корпус: SOD-123; Наименование: MBR0530T1G; HelpURL: https://www.onsemi.com/products/discretes-drivers/diodes-rectifiers/schottky-diodes-schottky-rectifiers/mbr0530t1g
VD7 = vd0009: =Описание; ID: vd0009; Фамилия: Ларионов; Описание: Двунаправленная диодная сборка для подавления помех 53 В; Производитель: Littelfuse, Inc.; Корпус: DO-214AB; Наименование: 1.5SMC62CA; HelpURL: https://www.littelfuse.com/products/tvs-diodes/surface-mount/1_5smc.aspx
X2 = x0022: =Описание; Contact_1: VDD; Contact_2: SWCLK; Contact_3: GND; Contact_4: SWDIO; Contact_5: nRST; Contact_6: SWO; ID: x0022; Фамилия: Паньков; Описание: Box Header 6 pin 2,54 мм вилка прямой; Производитель: Connfly Electronic Co., Ltd.; Наименование: DS1013-06SSiB1-B-0; HelpURL: http://en.connfly.group/product/xVkr=EusQssAN0gN=Aos=mU+UrVkR9kqEAN0gN9g+Upc+NB+A
X3 = x0006: =Описание; Contact_1: GND; Contact_2: TX; Contact_3: RX; ID: x0006; Фамилия: Ларионов; Описание: ATX Power 4 pin гнездо прямой; Производитель: TE Connectivity; Contact_4: GND; Наименование: 4-1775099-0; HelpURL: https://www.te.com/usa-en/product-4-1775099-0.html
X4 = x0006: =Описание; Contact_1: +12V; Contact_3: GND; ID: x0006; Фамилия: Ларионов; Описание: ATX Power 4 pin гнездо прямой; Производитель: TE Connectivity; Contact_2: +12V; Contact_4: GND; Наименование: 4-1775099-0; HelpURL: https://www.te.com/usa-en/product-4-1775099-0.html
X5 X6 = x0047: =Описание; Contact_1: +5V; Contact_2: A1; Contact_3: A2; Contact_4: D1; Contact_5: GND; ID: x0047; Фамилия: Паньков; Описание: CWF 5 pin 2,5 мм вилка прямой; Производитель: Connfly Electronic Co., Ltd.; Наименование: DS1069-5MVW6X; HelpURL: http://en.connfly.group/product/xVkr=EusQssAN0gN=Aos=mU+UrVkR9kqEAN0gN0MUR+g+NB+A
X7 = x0046: =Описание; Contact_1: PBOUT; Contact_2: INT; Contact_3: RST; Contact_4: KILLSW; Contact_5: GND; ID: x0046; Фамилия: Паньков; Описание: CWF 5 pin Type A 2,5 мм вилка угловой; Производитель: Connfly Electronic Co., Ltd.; Наименование: DS1069-5MRW6XA; HelpURL: http://en.connfly.group/product/xVkr=EusQssAN0gN=Aos=mU+UrVkR9kqEAN0gN0MUR+g+NB+A

## Sheet sokolov_control_board_3.SchDoc: Плата управления ПДУ
size 594 x 420 mm; ApprovedBy: Капустин; CheckedBy: Капустин; DrawnBy: Соколов; DocumentNumber: СПБПУ.3331506.022Ý3; SheetNumber: 3; SheetTotal: 3; DocumentCode: Ý3; ImagePath: СПБПУ.3331506.022
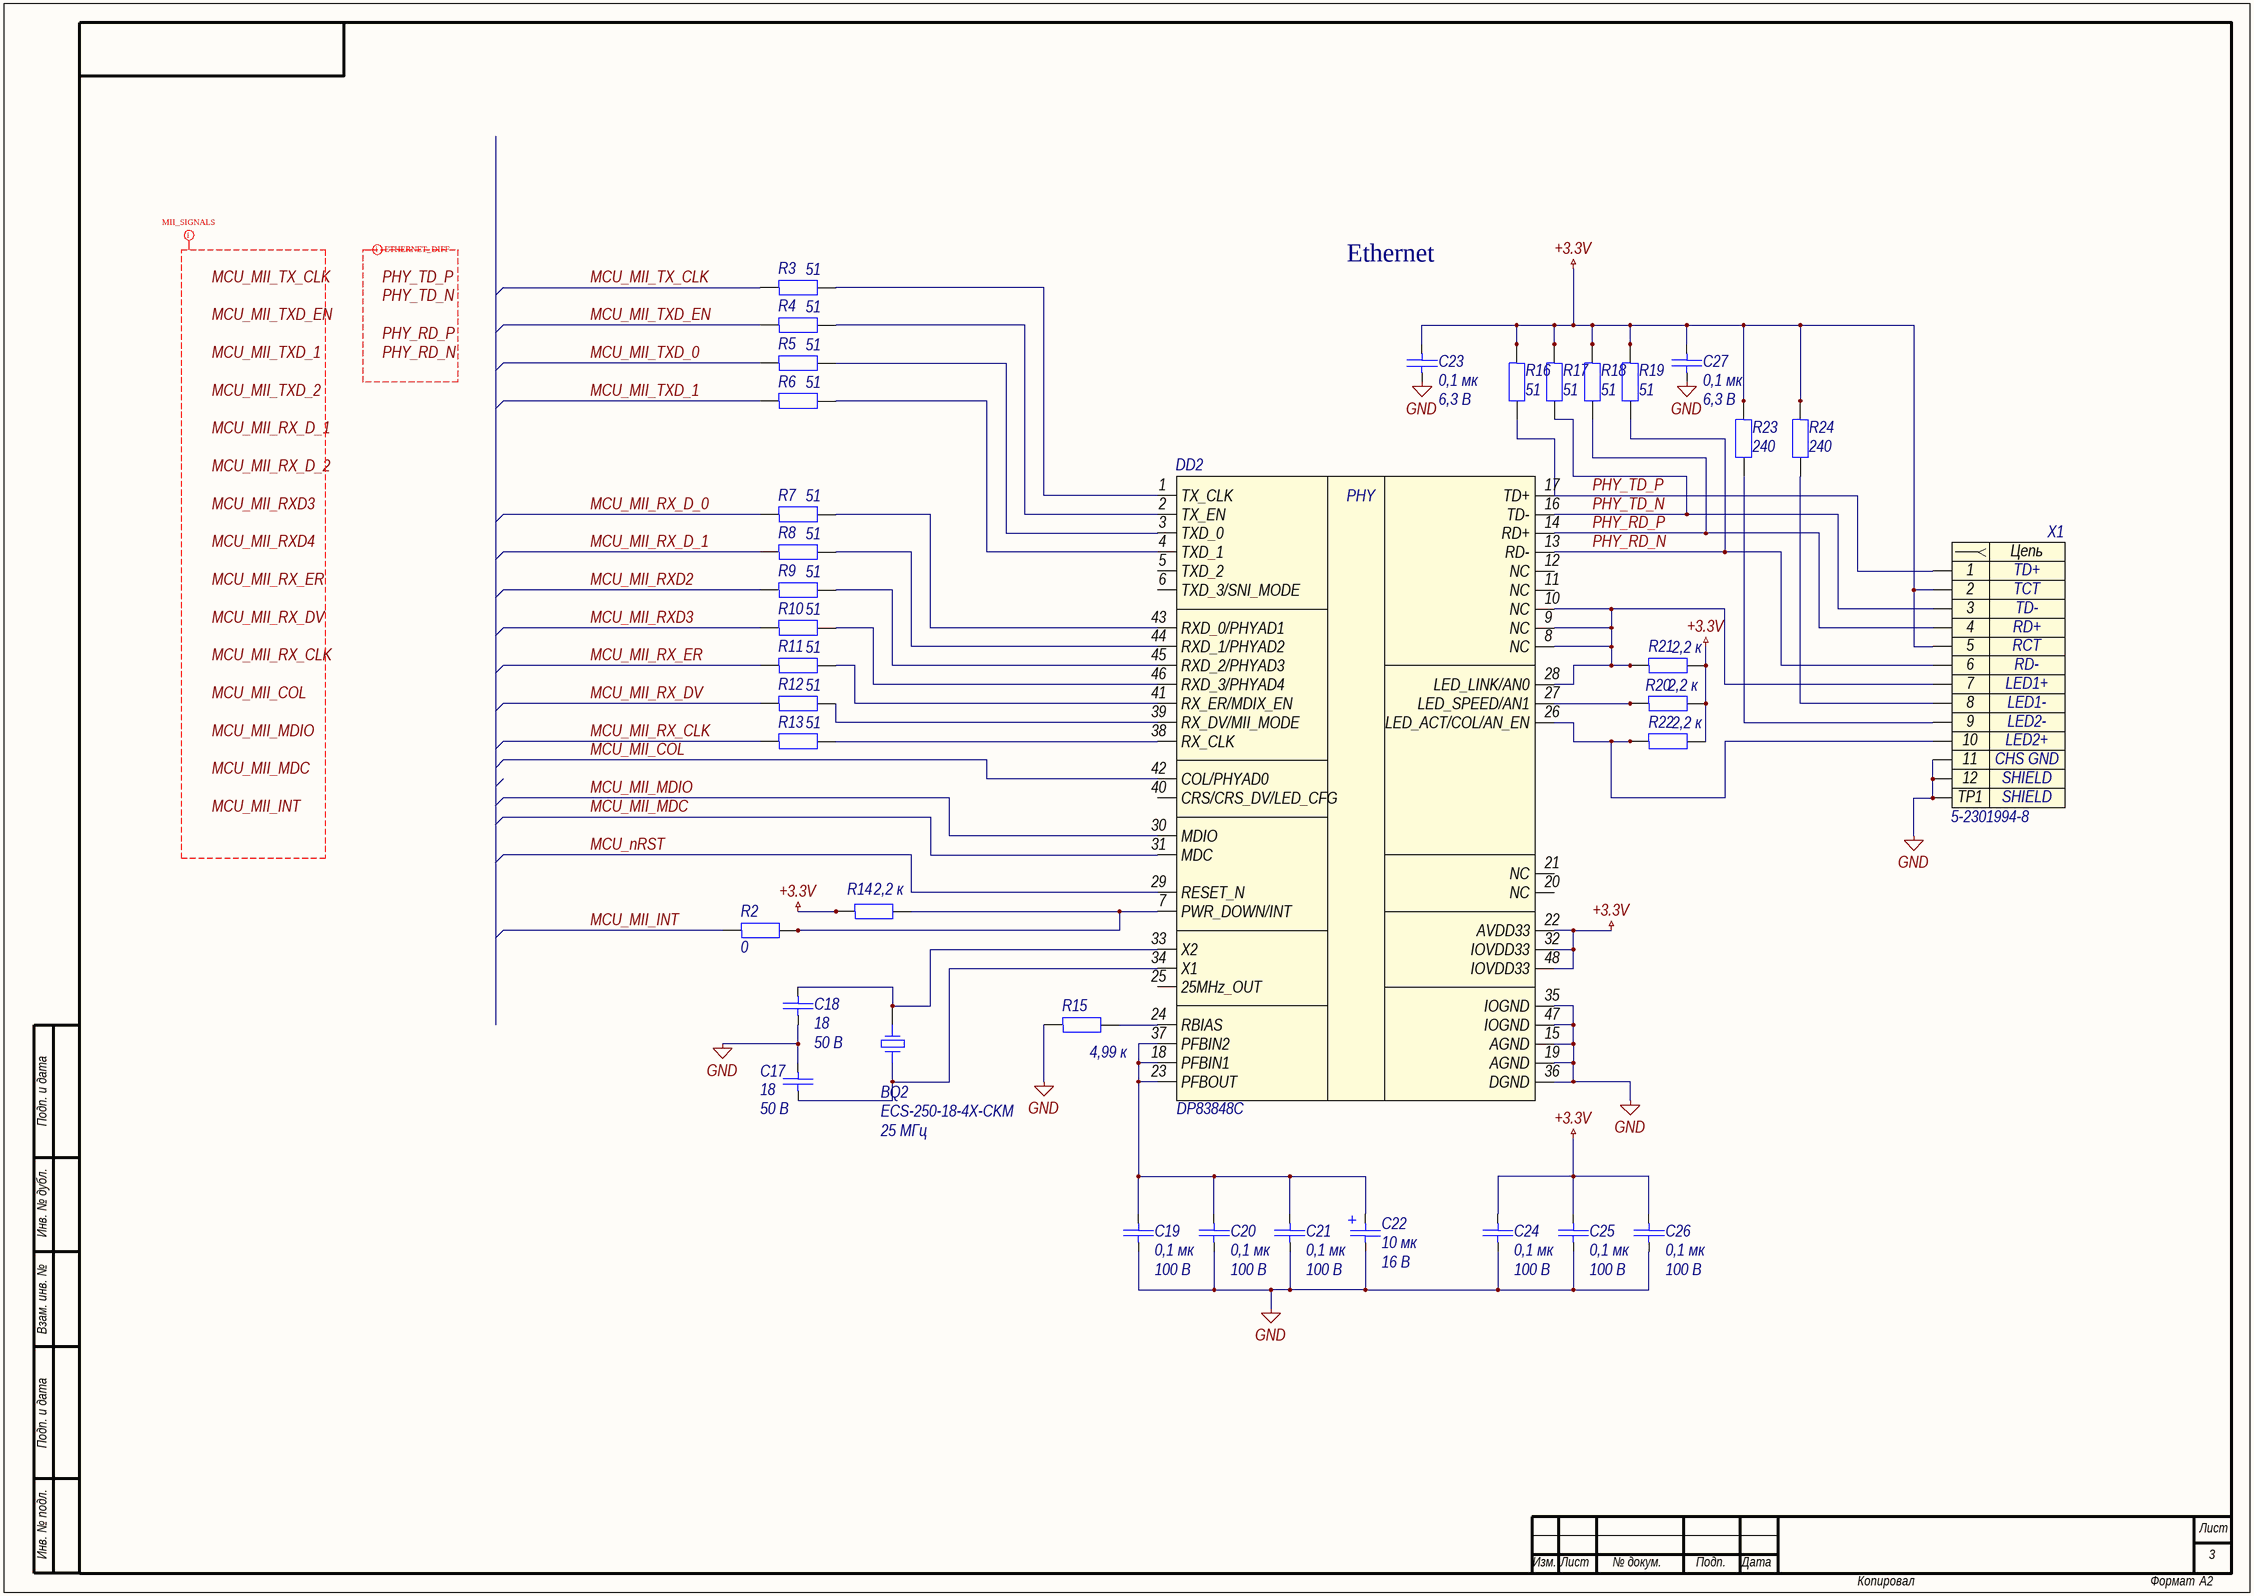
[diagram p2: sokolov_control_board_3.SchDoc]

### Parts
BQ2  ECS-250-18-4X-CKM  Частотa: 25 МГц  [HC-49/US]
C17  18  Напряжение: 50 В  [C0603]
C18  18  Напряжение: 50 В  [C0603]
C19  0,1 мк  Напряжение: 100 В  [C0603]
C20  0,1 мк  Напряжение: 100 В  [C0603]
C21  0,1 мк  Напряжение: 100 В  [C0603]
C22  10 мк  Напряжение: 16 В  [C3216-18]
C23  0,1 мк  Напряжение: 6,3 В  [C0402]
C24  0,1 мк  Напряжение: 100 В  [C0603]
C25  0,1 мк  Напряжение: 100 В  [C0603]
C26  0,1 мк  Напряжение: 100 В  [C0603]
C27  0,1 мк  Напряжение: 6,3 В  [C0402]
DD2  DP83848C  [LQFP-48-P50-700X700X160-L60X22]
R2  0  [R0603]
R3  51  [R0603]
R4  51  [R0603]
R5  51  [R0603]
R6  51  [R0603]
R7  51  [R0603]
R8  51  [R0603]
R9  51  [R0603]
R10  51  [R0603]
R11  51  [R0603]
R12  51  [R0603]
R13  51  [R0603]
R14  2,2 к  [R0603]
R15  4,99 к  [R0603]
R16  51  [R0603]
R17  51  [R0603]
R18  51  [R0603]
R19  51  [R0603]
R20  2,2 к  [R0603]
R21  2,2 к  [R0603]
R22  2,2 к  [R0603]
R23  240  [R0603]
R24  240  [R0603]
X1  5-2301994-8  [5-2301994-8]

### Nets
+3.3V: C23.2 C24.2 C25.2 C26.2 C27.2 DD2.22(AVDD33) DD2.32(IOVDD33) DD2.48(IOVDD33) R14.1 R16.1 R17.1 R18.1 R19.1 R20.2 R21.2 R22.2 R23.1 R24.1 X1.2 X1.5
GND: C17.2 C18.1 C19.1 C20.1 C21.1 C22.2 C23.1 C24.1 C25.1 C26.1 C27.1 DD2.15(AGND) DD2.19(AGND) DD2.35(IOGND) DD2.36(DGND) DD2.47(IOGND) R15.1 X1.11 X1.12 X1.TP1
MCU_MII_COL: DD2.42(COL/PHYAD0)
MCU_MII_INT: R2.1
MCU_MII_MDC: DD2.31(MDC)
MCU_MII_MDIO: DD2.30(MDIO)
MCU_MII_RX_CLK: R13.1
MCU_MII_RX_D_0: R7.1
MCU_MII_RX_D_1: R8.1
MCU_MII_RX_DV: R12.1
MCU_MII_RX_ER: R11.1
MCU_MII_RXD2: R9.1
MCU_MII_RXD3: R10.1
MCU_MII_TX_CLK: R3.1
MCU_MII_TXD_0: R5.1
MCU_MII_TXD_1: R6.1
MCU_MII_TXD_EN: R4.1
MCU_nRST: DD2.29(RESET_N)
PHY_RD_N: DD2.13(RD-) R19.2 X1.6
PHY_RD_P: DD2.14(RD+) R18.2 X1.4
PHY_TD_N: DD2.16(TD-) R17.2 X1.3
PHY_TD_P: DD2.17(TD+) R16.2 X1.1
NetBQ2_1: BQ2.1 C17.1 DD2.34(X1)
NetBQ2_2: BQ2.2 C18.2 DD2.33(X2)
NetC19_2: C19.2 C20.2 C21.2 C22.1 DD2.18(PFBIN1) DD2.23(PFBOUT) DD2.37(PFBIN2)
NetDD2_1: DD2.1(TX_CLK) R3.2
NetDD2_2: DD2.2(TX_EN) R4.2
NetDD2_3: DD2.3(TXD_0) R5.2
NetDD2_4: DD2.4(TXD_1) R6.2
NetDD2_7: DD2.7(PWR_DOWN/INT) R2.2 R14.2
NetDD2_8: DD2.8(NC) DD2.9(NC) DD2.10(NC) DD2.28(LED_LINK/AN0) R21.1 X1.7
NetDD2_24: DD2.24(RBIAS) R15.2
NetDD2_26: DD2.26(LED_ACT/COL/AN_EN) R22.1 X1.10
NetDD2_27: DD2.27(LED_SPEED/AN1) R20.1
NetDD2_38: DD2.38(RX_CLK) R13.2
NetDD2_39: DD2.39(RX_DV/MII_MODE) R12.2
NetDD2_41: DD2.41(RX_ER/MDIX_EN) R11.2
NetDD2_43: DD2.43(RXD_0/PHYAD1) R7.2
NetDD2_44: DD2.44(RXD_1/PHYAD2) R8.2
NetDD2_45: DD2.45(RXD_2/PHYAD3) R9.2
NetDD2_46: DD2.46(RXD_3/PHYAD4) R10.2
NetR23_2: R23.2 X1.9
NetR24_2: R24.2 X1.8

Not connected (* = marked no-connect by the designer): DD2 5(TXD_2) 6(TXD_3/SNI_MODE) 11(NC) 12(NC) 20(NC) 21(NC) 25(25MHz_OUT) 40(CRS/CRS_DV/LED_CFG)

### Layout directives
rule Width Constraint [Pref Impedance = 50,00ohms    Min Impedance = 50,00ohms    Max Impedance = 50,00ohms]; net class MII_CLASS: MCU_MII_COL, MCU_MII_INT, MCU_MII_MDC, MCU_MII_MDIO, MCU_MII_RX_CLK, MCU_MII_RX_D_1, MCU_MII_RX_D_2, MCU_MII_RX_DV, MCU_MII_RX_ER, MCU_MII_RXD3, MCU_MII_RXD4, MCU_MII_TX_CLK, MCU_MII_TXD_1, MCU_MII_TXD_2, MCU_MII_TXD_EN
differential pair; rule Differential Pairs Routing [Pref Gap = 0.254mm    Min Gap  = 0.15mm    Max Gap  = 0.254mmPref Width = 0.381mm    Min Width  = 0.155mm    Max Width  = 0.381mm]; differential pair class ETHERNET_DIFF_CLASS: PHY_RD_N, PHY_RD_P, PHY_TD_N, PHY_TD_P

### Notes on the sheet
- Ethernet
- Labels drawn without touching a wire or pin: MCU_MII_COL, MCU_MII_INT, MCU_MII_MDC, MCU_MII_MDIO, MCU_MII_RX_CLK, MCU_MII_RX_D_1, MCU_MII_RX_D_2, MCU_MII_RX_DV, MCU_MII_RX_ER, MCU_MII_RXD3, MCU_MII_RXD4, MCU_MII_TX_CLK, MCU_MII_TXD_1, MCU_MII_TXD_2, MCU_MII_TXD_EN, PHY_RD_N, PHY_RD_P, PHY_TD_N, PHY_TD_P
- Подп. и дата
- Инв. № дубл.
- Взам. инв. №
- Инв. № подл.
- Лист
- Изм.
- № докум.
- Подп.
- Дата
- Копировал
- Формат
- А2
- (in symbol dd0005) PHY
- (in symbol x0015) Цепь

### Library data of the parts
BQ2 = bq0007: =Описание; ID: bq0007; Фамилия: Соколов; Описание: Кварцевый резонатор 25 МГц нагрузочные конденсаторы 18 пФ; Производитель: ECS, Inc. International; Корпус: HC-49/USX; Наименование: ECS-250-18-4X-CKM; Частота: 25 МГц; HelpURL: https://ru.mouser.com/datasheet/2/122/hc_49usx-791.pdf
C17 C18 = c0180: =Описание; ID: c0180; Фамилия: Соколов; Описание: Конденсатор керамический чип 0603 18 пФ 50 В ±1 %; Наименование: CC0603FRNPO9BN200; Производитель: YAGEO Corp.; Отклонение: ±1 %; Рабочие температуры: от –55 °С до +125 °С; Температурный коэффициент емкости: C0G; Корпус: 0603; Номинал: 18; Номинальное напряжение: 50 В; HelpURL: https://www.yageo.com/upload/media/product/productsearch/datasheet/mlcc/UPY-GP_NP0_16V-to-50V_18.pdf
C19-C21 C24-C26 = c0089: =Описание; ID: c0089; Фамилия: Ларионов; Описание: Конденсатор керамический чип 0603 100 нФ 100 В ±10 %; Наименование: CC0603KRX7R0BB104; Производитель: YAGEO Corp.; Отклонение: ±10 %; Рабочие температуры: от –55 °С до +125 °С; Температурный коэффициент емкости: X7R; Корпус: 0603; Номинал: 0,1 мк; Номинальное напряжение: 100 В; HelpURL: https://www.yageo.com/upload/media/product/productsearch/datasheet/mlcc/UPY-NP0X7R_MV_100-to-630V_22.pdf
C22 = c0074: =Описание; ID: c0074; Фамилия: Паньков; Описание: Конденсатор танталовый чип 3216-18 10 мкФ 16 В ±10 %; Наименование: 293D106X9016A2TE3; Производитель: Vishay Intertechnology, Inc.; Отклонение: ±10 %; Эквивалентное последовательное сопротивление: 3,0 Ом; Среднеквадратичный размах пульсации тока: 0,16 А; Рабочие температуры: от –55 °С до +125 °С; Корпус: 3216-18; Номинал: 10 мк; Номинальное напряжение: 16 В; HelpURL: https://www.vishay.com/capacitors/list/product-40002/
C23 C27 = c0078: =Описание; ID: c0078; Фамилия: Паньков; Описание: Конденсатор керамический чип 0402 100 нФ 6,3 В ±10 %; Наименование: CC0402KRX5R5BB104; Производитель: YAGEO Corp.; Отклонение: ±10 %; Рабочие температуры: от –55 °С до +85 °С; Температурный коэффициент емкости: X5R; Корпус: 0402; Номинал: 0,1 мк; Номинальное напряжение: 6,3 В; HelpURL: https://www.yageo.com/upload/media/product/productsearch/datasheet/mlcc/UPY-GPHC_X5R_4V-to-50V_26.pdf
DD2 = dd0005: =Описание; Manufacturer: NationalSemiconductor; PackageTopMarking: NSUZXYTTDP83848VVVBC; PowerWise: N; CompType: InterfaceIC; ComponentLink1DescBC: DP83848CDatasheet; ComponentLink2DescA4: DP83848CWebPage; ComponentLink3DescAC: VBH48APackagePage; ID: dd0005; Фамилия: Соколов; Описание: Приемопередатчик Ethernet PHY 10/100 Мбит / с с интерфейсом SNI и поддержкой JTAG; Производитель: TI; Корпус: LQFP-48; Copyright: Copyright (C) 2018 Accelerated Designs. All rights reserved; Published: 4-Dec-2008; DatasheetVersion: May-2008; PackageVersion: revEMay-2007; PackageReference: VBH48A; Publisher: AltiumLimited; PackageDescription: LQFP7x7x14mm48Lead05mmPitch; SUPPLIER_3: 1Farnell; SUPPLIER_2: PartNumb0C1286816; SUPPLIER_4: 2Farnell; Supplier: PartNumb0F1528379; PartNumber: DP83848CVV; RoHS: Y; PinCount: 48; ComponentLink1URL: http//wwwnationalcom/ds/DP/DP83848Cpdf; ComponentLink2URL: http//wwwnationalcom/pf/DP/DP83848Chtml; ComponentLink3URL: http//wwwnationalcom/packaging/folders/vbh48ahtml; Наименование: DP83848C; HelpURL: https://www.ti.com/lit/gpn/dp83848c
R2 = r0001: =Описание; ID: r0001; Фамилия: Соколов; Описание: Резистор чип 0603 0 Ом ±1 % 0,1 Вт; Наименование: RC0603FR-130RL; Производитель: YAGEO Corp.; Отклонение: ±1 %; Номинальное напряжение: 75 В; Номинальный ток: 1 А; Рабочие температуры: от –55 °С до +155 °С; Корпус: 0603; Номинал: 0; HelpURL: https://www.yageo.com/upload/media/product/productsearch/datasheet/rchip/PYu-RC_Group_51_RoHS_L_11.pdf
R3-R13 R16-R19 = r0044: =Описание; ID: r0044; Фамилия: Паньков; Описание: Резистор чип 0603 51 Ом ±1 % 0,1 Вт; Наименование: RC0603FR-0751RL; Производитель: YAGEO Corp.; Отклонение: ±1 %; Номинальное напряжение: 75 В; Номинальный ток: 1 А; Рабочие температуры: от –55 °С до +155 °С; Корпус: 0603; Примечание: Ряд E24; Номинал: 51; HelpURL: https://www.yageo.com/upload/media/product/productsearch/datasheet/rchip/PYu-RC_Group_51_RoHS_L_11.pdf
R14 R20-R22 = r0085: =Описание; ID: r0085; Фамилия: Паньков; Описание: Резистор чип 0603 2,2 кОм ±1 % 0,1 Вт; Наименование: RC0603FR-072K2L; Производитель: YAGEO Corp.; Отклонение: ±1 %; Номинальное напряжение: 75 В; Номинальный ток: 1 А; Рабочие температуры: от –55 °С до +155 °С; Корпус: 0603; Примечание: Ряд E24; Номинал: 2,2 к; HelpURL: https://www.yageo.com/upload/media/product/productsearch/datasheet/rchip/PYu-RC_Group_51_RoHS_L_11.pdf
R15 = r0095: =Описание; ID: r0095; Фамилия: Жернаков; Описание: Резистор чип 0603 4,99 кОм ±1 % 0,1 Вт; Наименование: RC0603FR-074K99L; Производитель: YAGEO Corp.; Отклонение: ±1 %; Номинальное напряжение: 75 В; Номинальный ток: 1 А; Рабочие температуры: от –55 °С до +155 °С; Корпус: 0603; Номинал: 4,99 к; HelpURL: https://www.yageo.com/upload/media/product/productsearch/datasheet/rchip/PYu-RC_Group_51_RoHS_L_11.pdf
R23 R24 = r0061: =Описание; ID: r0061; Фамилия: Паньков; Описание: Резистор чип 0603 240 Ом ±1 % 0,1 Вт; Наименование: RC0603FR-07240RL; Производитель: YAGEO Corp.; Отклонение: ±1 %; Номинальное напряжение: 75 В; Номинальный ток: 1 А; Рабочие температуры: от –55 °С до +155 °С; Корпус: 0603; Примечание: Ряд E24; Номинал: 240; HelpURL: https://www.yageo.com/upload/media/product/productsearch/datasheet/rchip/PYu-RC_Group_51_RoHS_L_11.pdf
X1 = x0015: =Описание; Contact_1: TD+; Contact_2: TCT; Contact_3: TD-; Contact_4: RD+; Contact_5: RCT; Contact_6: RD-; Contact_7: LED1+; Contact_8: LED1-; Contact_9: LED2-; Contact_10: LED2+; Contact_11: CHS GND; TP1: SHIELD; ID: x0015; Фамилия: Ларионов; Описание: RJ45 интегрированный трансформатор 10/100 Mbps LED гнездо угловой; Производитель: TE Connectivity; Contact_12: SHIELD; Наименование: 5-2301994-8; HelpURL: https://www.te.com/usa-en/product-5-2301994-8.html

## Nets that join several sheets
+3.3V: sokolov_control_board_1 (18 pins), sokolov_control_board_2 (14 pins), sokolov_control_board_3 (20 pins)
GND: sokolov_control_board_1 (24 pins), sokolov_control_board_2 (42 pins), sokolov_control_board_3 (20 pins)
MCU_INT: sokolov_control_board_1 (DD1.23), sokolov_control_board_2 (R33.2 X7.2)
MCU_J1_A1: sokolov_control_board_1 (DD1.85), sokolov_control_board_2 (X5.2)
MCU_J1_A2: sokolov_control_board_1 (DD1.86), sokolov_control_board_2 (X5.3)
MCU_J1_D1: sokolov_control_board_1 (DD1.87), sokolov_control_board_2 (X5.4)
MCU_J2_A1: sokolov_control_board_1 (DD1.55), sokolov_control_board_2 (X6.2)
MCU_J2_A2: sokolov_control_board_1 (DD1.56), sokolov_control_board_2 (X6.3)
MCU_J2_D1: sokolov_control_board_1 (DD1.57), sokolov_control_board_2 (X6.4)
MCU_MII_COL: sokolov_control_board_1 (DD1.26), sokolov_control_board_3 (DD2.42)
MCU_MII_INT: sokolov_control_board_1 (DD1.53), sokolov_control_board_3 (R2.1)
MCU_MII_MDC: sokolov_control_board_1 (DD1.16), sokolov_control_board_3 (DD2.31)
MCU_MII_MDIO: sokolov_control_board_1 (DD1.25), sokolov_control_board_3 (DD2.30)
MCU_MII_RX_CLK: sokolov_control_board_1 (DD1.24), sokolov_control_board_3 (R13.1)
MCU_MII_RX_D_0: sokolov_control_board_1 (DD1.33), sokolov_control_board_3 (R7.1)
MCU_MII_RX_D_1: sokolov_control_board_1 (DD1.34), sokolov_control_board_3 (R8.1)
MCU_MII_RX_DV: sokolov_control_board_1 (DD1.32), sokolov_control_board_3 (R12.1)
MCU_MII_RX_ER: sokolov_control_board_1 (DD1.47), sokolov_control_board_3 (R11.1)
MCU_MII_RXD2: sokolov_control_board_1 (DD1.35), sokolov_control_board_3 (R9.1)
MCU_MII_RXD3: sokolov_control_board_1 (DD1.36), sokolov_control_board_3 (R10.1)
MCU_MII_TX_CLK: sokolov_control_board_1 (DD1.18), sokolov_control_board_3 (R3.1)
MCU_MII_TXD_0: sokolov_control_board_1 (DD1.51), sokolov_control_board_3 (R5.1)
MCU_MII_TXD_1: sokolov_control_board_1 (DD1.52), sokolov_control_board_3 (R6.1)
MCU_MII_TXD_EN: sokolov_control_board_1 (DD1.48), sokolov_control_board_3 (R4.1)
MCU_nKILL: sokolov_control_board_1 (DD1.29), sokolov_control_board_2 (X7.4)
MCU_nRST: sokolov_control_board_1 (C16.1 DD1.14 R1.1 S1.1), sokolov_control_board_2 (R34.2 VD5.6 X7.3), sokolov_control_board_3 (DD2.29)
MCU_PB: sokolov_control_board_1 (DD1.30), sokolov_control_board_2 (R32.2 X7.1)
MCU_SWCLK: sokolov_control_board_1 (DD1.76), sokolov_control_board_2 (VD4.6)
MCU_SWDIO: sokolov_control_board_1 (DD1.72), sokolov_control_board_2 (VD4.4)
MCU_SWO: sokolov_control_board_1 (DD1.89), sokolov_control_board_2 (VD5.4)
MCU_USART1_RX: sokolov_control_board_1 (DD1.69), sokolov_control_board_2 (DD3.12)
MCU_USART1_TX: sokolov_control_board_1 (DD1.68), sokolov_control_board_2 (DD3.11)